# Altium schematic sheet Power_Path_Controller.SchDoc
size A4
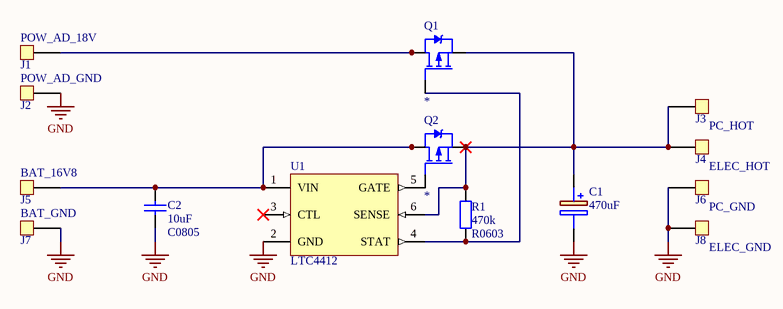
[diagram p0: Power_Path_Controller.SchDoc]

## Parts
C1  470uF  [CAPPRD350W60D800H1700]
C2  Capacitance: 10uF  [C0805]
J1  POW_AD_18V  [Wire_Pad]
J2  POW_AD_GND  [Wire_Pad]
J3  PC_HOT  [Wire_Pad]
J4  ELEC_HOT  [Wire_Pad]
J5  BAT_16V8  [Wire_Pad]
J6  PC_GND  [Wire_Pad]
J7  BAT_GND  [Wire_Pad]
J8  ELEC_GND  [Wire_Pad]
Q1  *  [TSOP95P280X110-6N]
Q2  *  [TSOP95P280X110-6N]
R1  470k  [R0603]
U1  LTC4412  [SOT-236]

## Nets
GND: C1.2(-) C2.1 J2.1 J6.1 J7.1 J8.1 U1.2(GND)
NetC1_1: C1.1(+) J3.1 J4.1 Q1.1(S) Q2.1(S) R1.2 U1.6(SENSE)
NetC2_2: C2.2 J5.1 Q2.3(D) Q2.D0(D) Q2.D1(D) Q2.D2(D) U1.1(VIN)
NetJ1_1: J1.1 Q1.3(D) Q1.D0(D) Q1.D1(D) Q1.D2(D)
NetQ1_2: Q1.2(G) R1.1 U1.4(STAT)
NetQ2_2: Q2.2(G) U1.5(GATE)

Not connected (* = marked no-connect by the designer): U1 3(CTL)*

## Notes on the sheet
- Title
- Size:
- Date:
- A4
- Number:
- Time:
- Revision:
- Sheet
- of
- File:

## Library data of the parts
C1 = EEUFC1E101S: Capacitor Polarised; Datasheet Link: *; Height: *; Manufacturer_Name: *; Manufacturer_Part_Number: *; Capacitance: *; Voltage Rating: *; Farnell Order Nr: *
C2 = Capacitor: Ceramic capacitor; Type: MLCC; Voltage rating: *V; ComponentLinknDescription: Datasheet; Characteristic: *; Manufacturer: *; ComponentLinknURL: *; Note: C0805
J1-J8 = Connection_pad
Q1 Q2 = P-Channel MOSFET: PartNumber: *; GS breakdown Volt: *; Farnell Order Nr: *; DS Breakdown Volt: *; Drain Current: *; rDSon: *; Parameter 2: *; Parameter 3: *; Datasheet: *
R1 = Resistor: Precision: *%; Voltage rating: *V; Temp coefficient: *ppm; Power rating: *mW; ComponentLinknDescription: Datasheet; Manufacturer: *; ComponentLinknURL: *; Resistance: 470k; Note: R0603
U1 = LTC4412: Manufacturer: Linear Technology; ComponentLinknDescription: Datasheet; Space heritage: false; Part number: LTC4412; Verified: false; ComponentLinknURL: *; Drawn by: Erik Ilbis